# EAGLE design DorothiController (EAGLE 9.2.2)

## Sheet 1 of 3
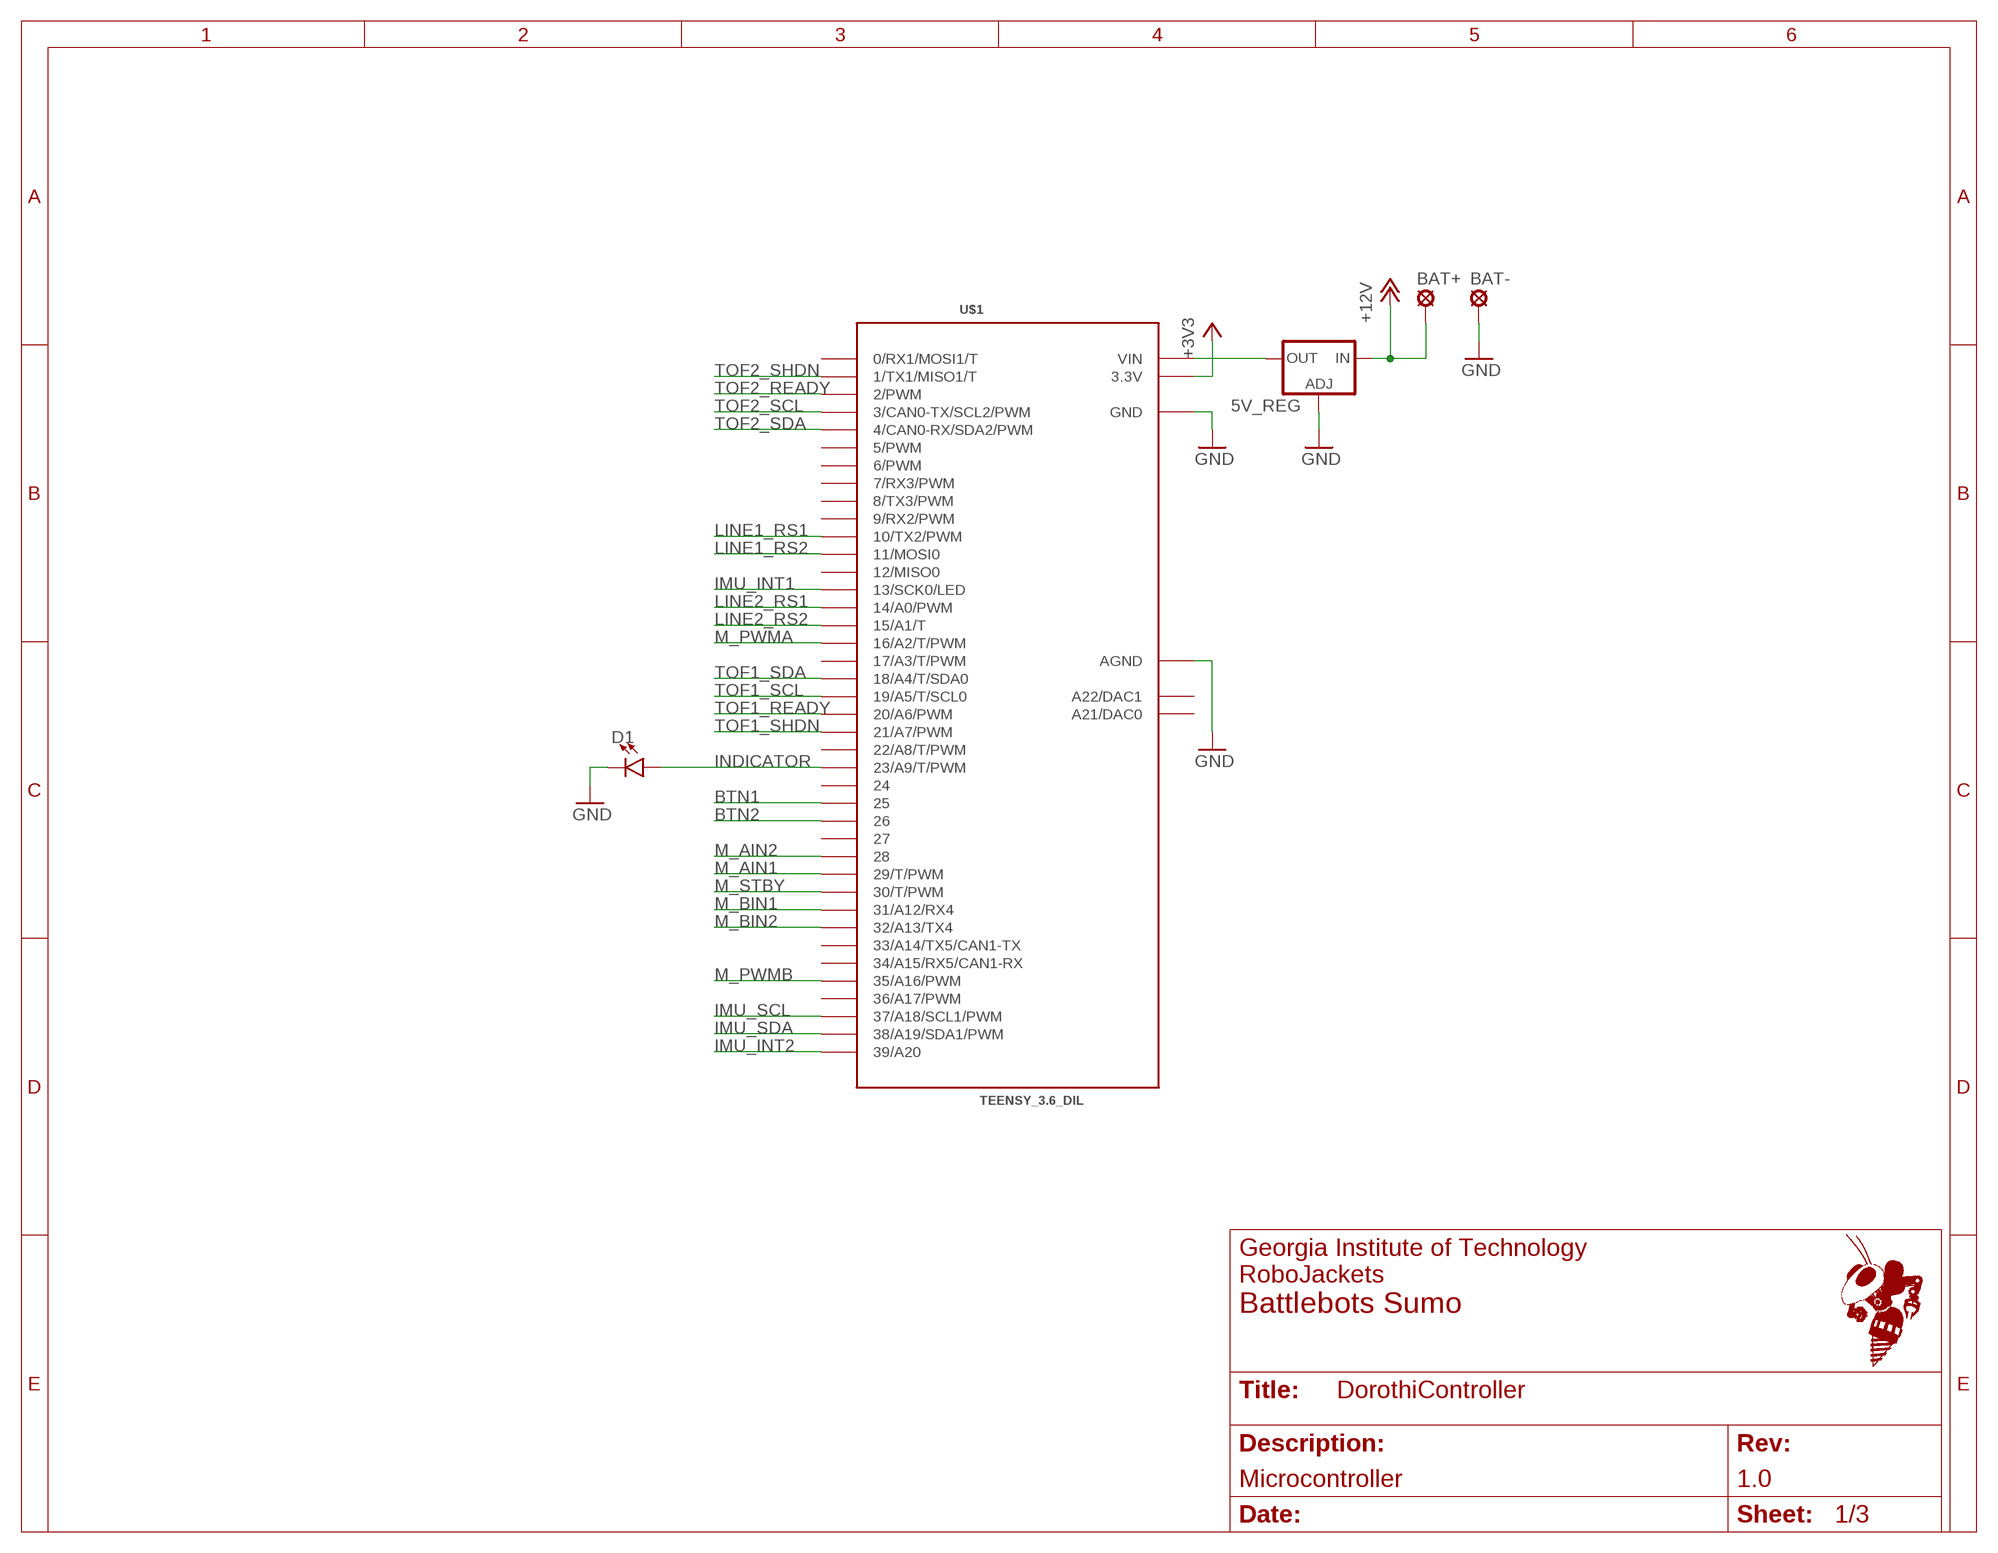
[diagram p0: schematic, sheet 1]
FRAME4 (FRAME_A_L): REVISION: 1.0; SCH_DESC: Microcontroller; TEAM: Battlebots Sumo

### Parts
5V_REG  LM138-TL  [TO220L1]
BAT+  24_SOLPAD  [WIRE_SOLPAD]
BAT-  24_SOLPAD  [WIRE_SOLPAD]
D1  LED0603  [LED-0603]
U$1  TEENSY_3.6_DIL  [TEENSY_3.6_DIL]

### Nets
5V_OUT: 5V_REG.2(OUT) U$1.VIN
+3V3: U$1.3.3V U$1.3.3V3(3.3V) ; also sheet 2,3
+12V: 5V_REG.3(IN) BAT+.P$1(MP) ; also sheet 2
BTN1: U$1.25 ; also sheet 3
BTN2: U$1.26 ; also sheet 3
GND: 5V_REG.1(ADJ) BAT-.P$1(MP) D1.C U$1.AGND U$1.GND U$1.GND1(GND) ; also sheet 2,3
IMU_INT1: U$1.13(13/SCK0/LED) ; also sheet 3
IMU_INT2: U$1.39/A20 ; also sheet 3
IMU_SCL: U$1.37/A18(37/A18/SCL1/PWM) ; also sheet 3
IMU_SDA: U$1.38/A19(38/A19/SDA1/PWM) ; also sheet 3
INDICATOR: D1.A U$1.23/A9(23/A9/T/PWM)
LINE1_RS1: U$1.10(10/TX2/PWM) ; also sheet 3
LINE1_RS2: U$1.11(11/MOSI0) ; also sheet 3
LINE2_RS1: U$1.14/A0(14/A0/PWM) ; also sheet 3
LINE2_RS2: U$1.15/A1(15/A1/T) ; also sheet 3
M_AIN1: U$1.29(29/T/PWM) ; also sheet 2
M_AIN2: U$1.28 ; also sheet 2
M_BIN1: U$1.31/A12(31/A12/RX4) ; also sheet 2
M_BIN2: U$1.32/A13(32/A13/TX4) ; also sheet 2
M_PWMA: U$1.16/A2(16/A2/T/PWM) ; also sheet 2
M_PWMB: U$1.35/A16(35/A16/PWM) ; also sheet 2
M_STBY: U$1.30(30/T/PWM) ; also sheet 2
TOF1_READY: U$1.20/A6(20/A6/PWM) ; also sheet 3
TOF1_SCL: U$1.19/A5(19/A5/T/SCL0) ; also sheet 3
TOF1_SDA: U$1.18/A4(18/A4/T/SDA0) ; also sheet 3
TOF1_SHDN: U$1.21/A7(21/A7/PWM) ; also sheet 3
TOF2_READY: U$1.2(2/PWM) ; also sheet 3
TOF2_SCL: U$1.3(3/CAN0-TX/SCL2/PWM) ; also sheet 3
TOF2_SDA: U$1.4(4/CAN0-RX/SDA2/PWM) ; also sheet 3
TOF2_SHDN: U$1.1(1/TX1/MISO1/T) ; also sheet 3
Unconnected: U$1.0(0/RX1/MOSI1/T) U$1.5(5/PWM) U$1.6(6/PWM) U$1.7(7/RX3/PWM) U$1.8(8/TX3/PWM) U$1.9(9/RX2/PWM) U$1.12(12/MISO0) U$1.17/A3(17/A3/T/PWM) U$1.22/A8(22/A8/T/PWM) U$1.24 U$1.27 U$1.33/A14(33/A14/TX5/CAN1-TX) U$1.34/A15(34/A15/RX5/CAN1-RX) U$1.36/A17(36/A17/PWM) U$1.A21(A21/DAC0) U$1.A22(A22/DAC1)

## Sheet 2 of 3
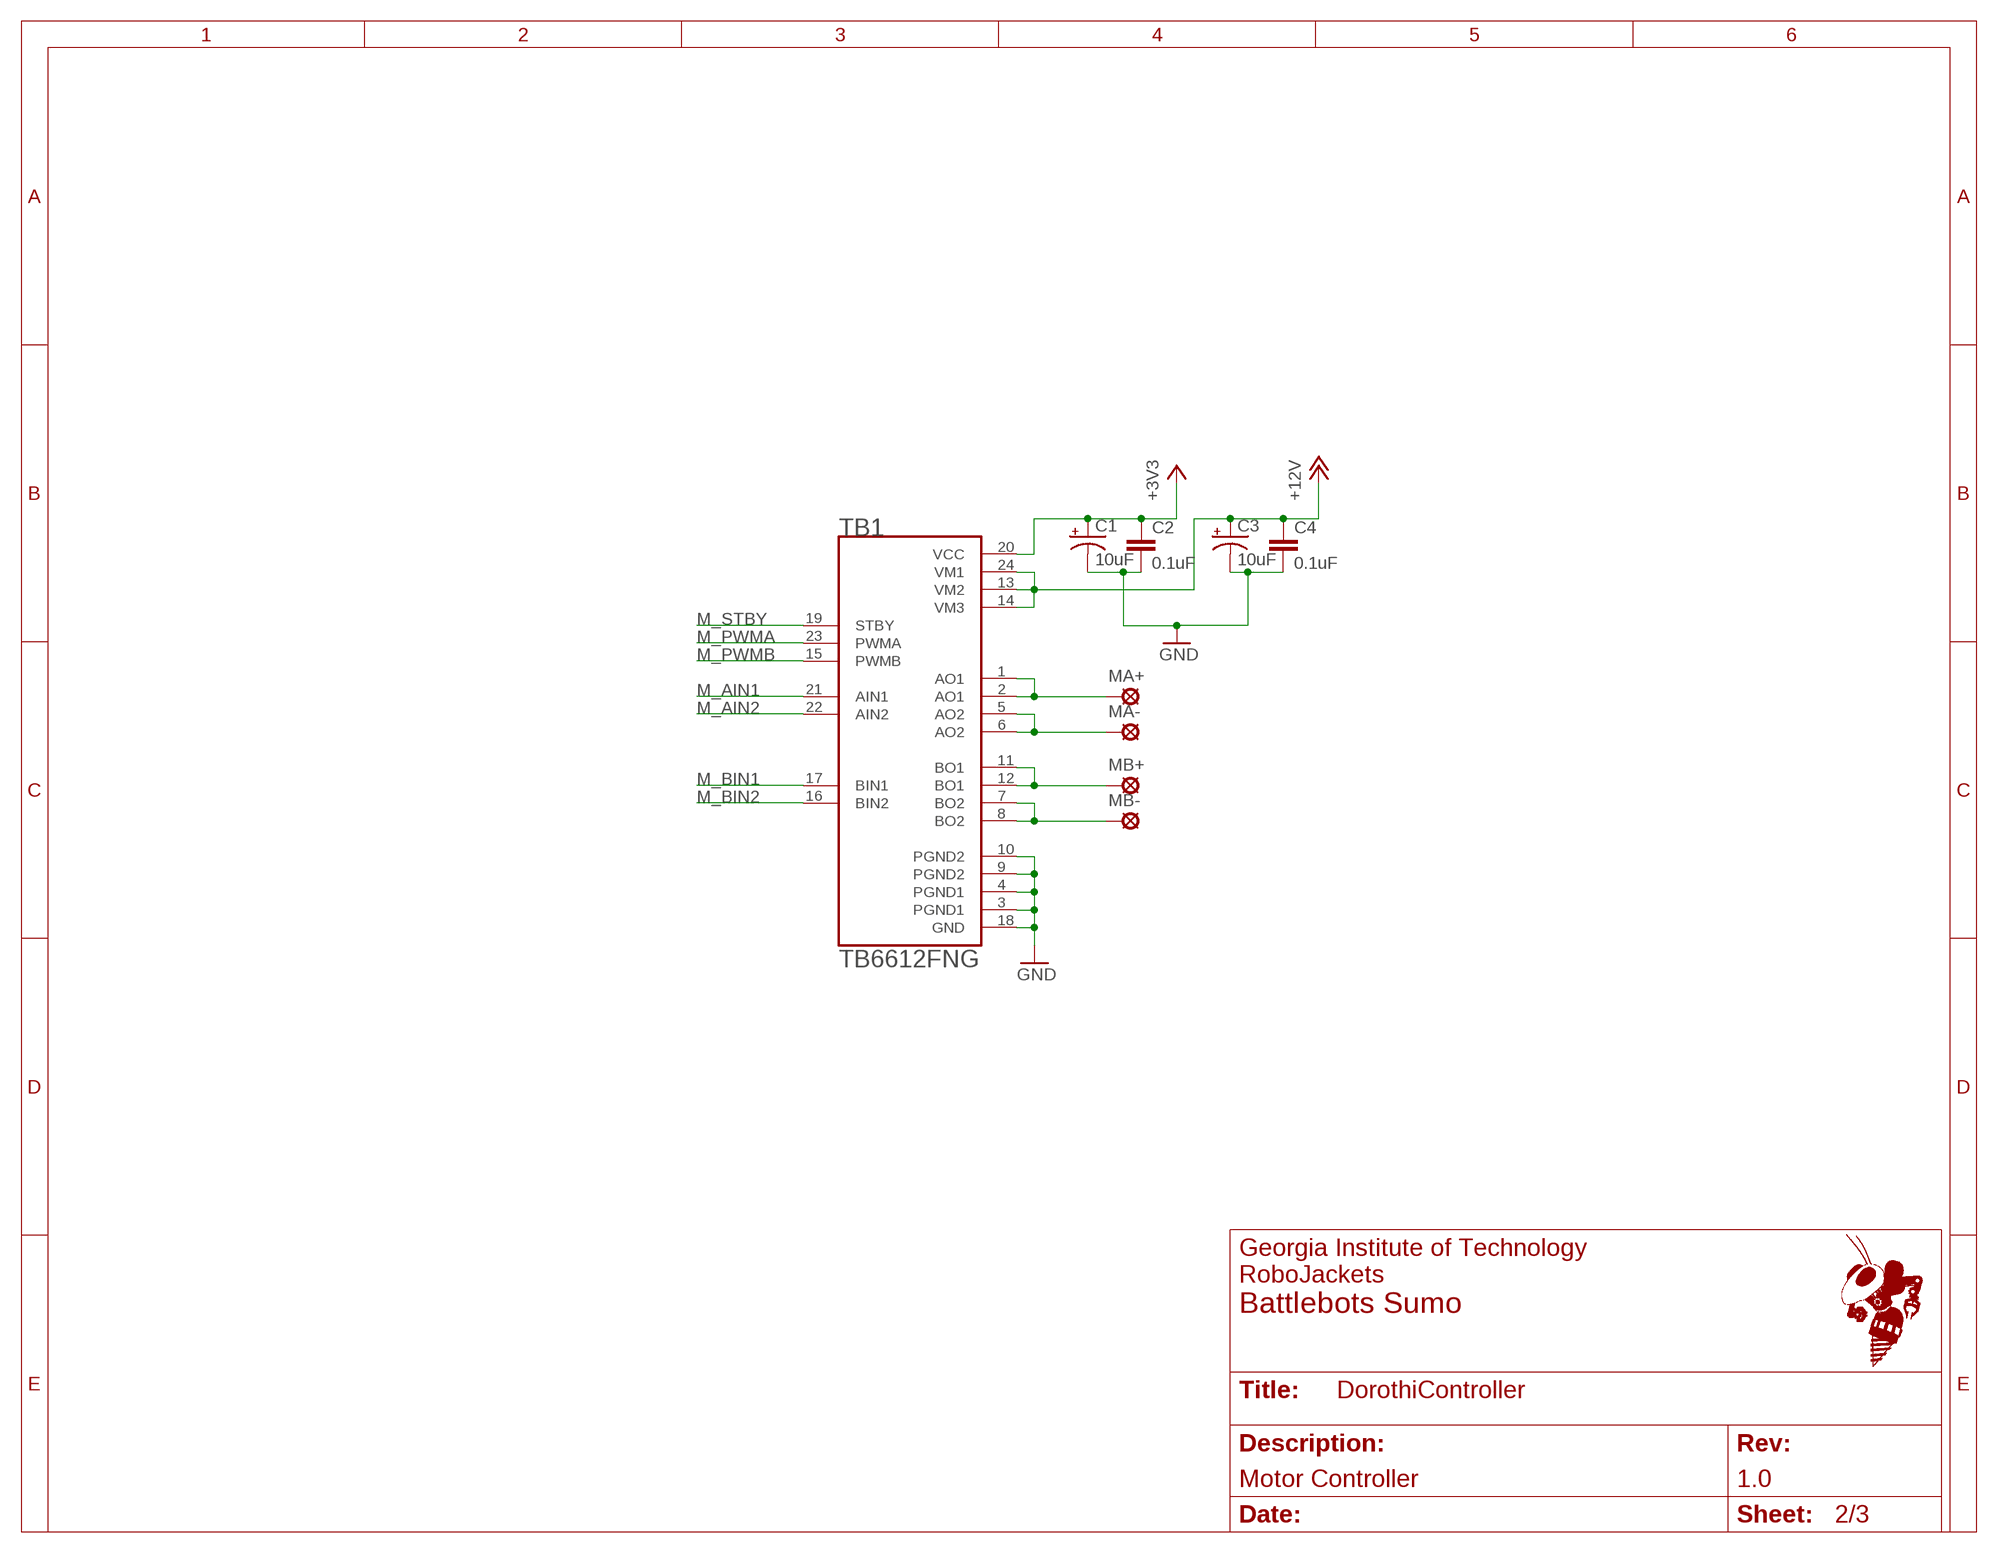
[diagram p1: schematic, sheet 2]
FRAME1 (FRAME_A_L): REVISION: 1.0; SCH_DESC: Motor Controller; TEAM: Battlebots Sumo

### Parts
C1  10uF  10UF-POLAR-EIA3528-20V-10%(TANT)  [EIA3528]
C2  0.1uF  0.1UF-0603-25V-5%  [0603]
C3  10uF  10UF-POLAR-EIA3528-20V-10%(TANT)  [EIA3528]
C4  0.1uF  0.1UF-0603-25V-5%  [0603]
MA+  24_SOLPAD  [WIRE_SOLPAD]
MA-  24_SOLPAD  [WIRE_SOLPAD]
MB+  24_SOLPAD  [WIRE_SOLPAD]
MB-  24_SOLPAD  [WIRE_SOLPAD]
TB1  TB6612FNG  TB6612FNG(O,C,8,EL  [SOP65P760X160-24N]

### Nets
+3V3: C1.A(+) C2.1 TB1.20(VCC) ; also sheet 1,3
+12V: C3.A(+) C4.1 TB1.13(VM2) TB1.14(VM3) TB1.24(VM1) ; also sheet 1
GND: C1.C(-) C2.2 C3.C(-) C4.2 TB1.3(PGND1) TB1.4(PGND1) TB1.9(PGND2) TB1.10(PGND2) TB1.18(GND) ; also sheet 1,3
M_AIN1: TB1.21(AIN1) ; also sheet 1
M_AIN2: TB1.22(AIN2) ; also sheet 1
M_BIN1: TB1.17(BIN1) ; also sheet 1
M_BIN2: TB1.16(BIN2) ; also sheet 1
M_PWMA: TB1.23(PWMA) ; also sheet 1
M_PWMB: TB1.15(PWMB) ; also sheet 1
M_STBY: TB1.19(STBY) ; also sheet 1
MA+: MA+.P$1(MP) TB1.1(AO1) TB1.2(AO1)
MA-: MA-.P$1(MP) TB1.5(AO2) TB1.6(AO2)
MB+: MB+.P$1(MP) TB1.11(BO1) TB1.12(BO1)
MB-: MB-.P$1(MP) TB1.7(BO2) TB1.8(BO2)

## Sheet 3 of 3
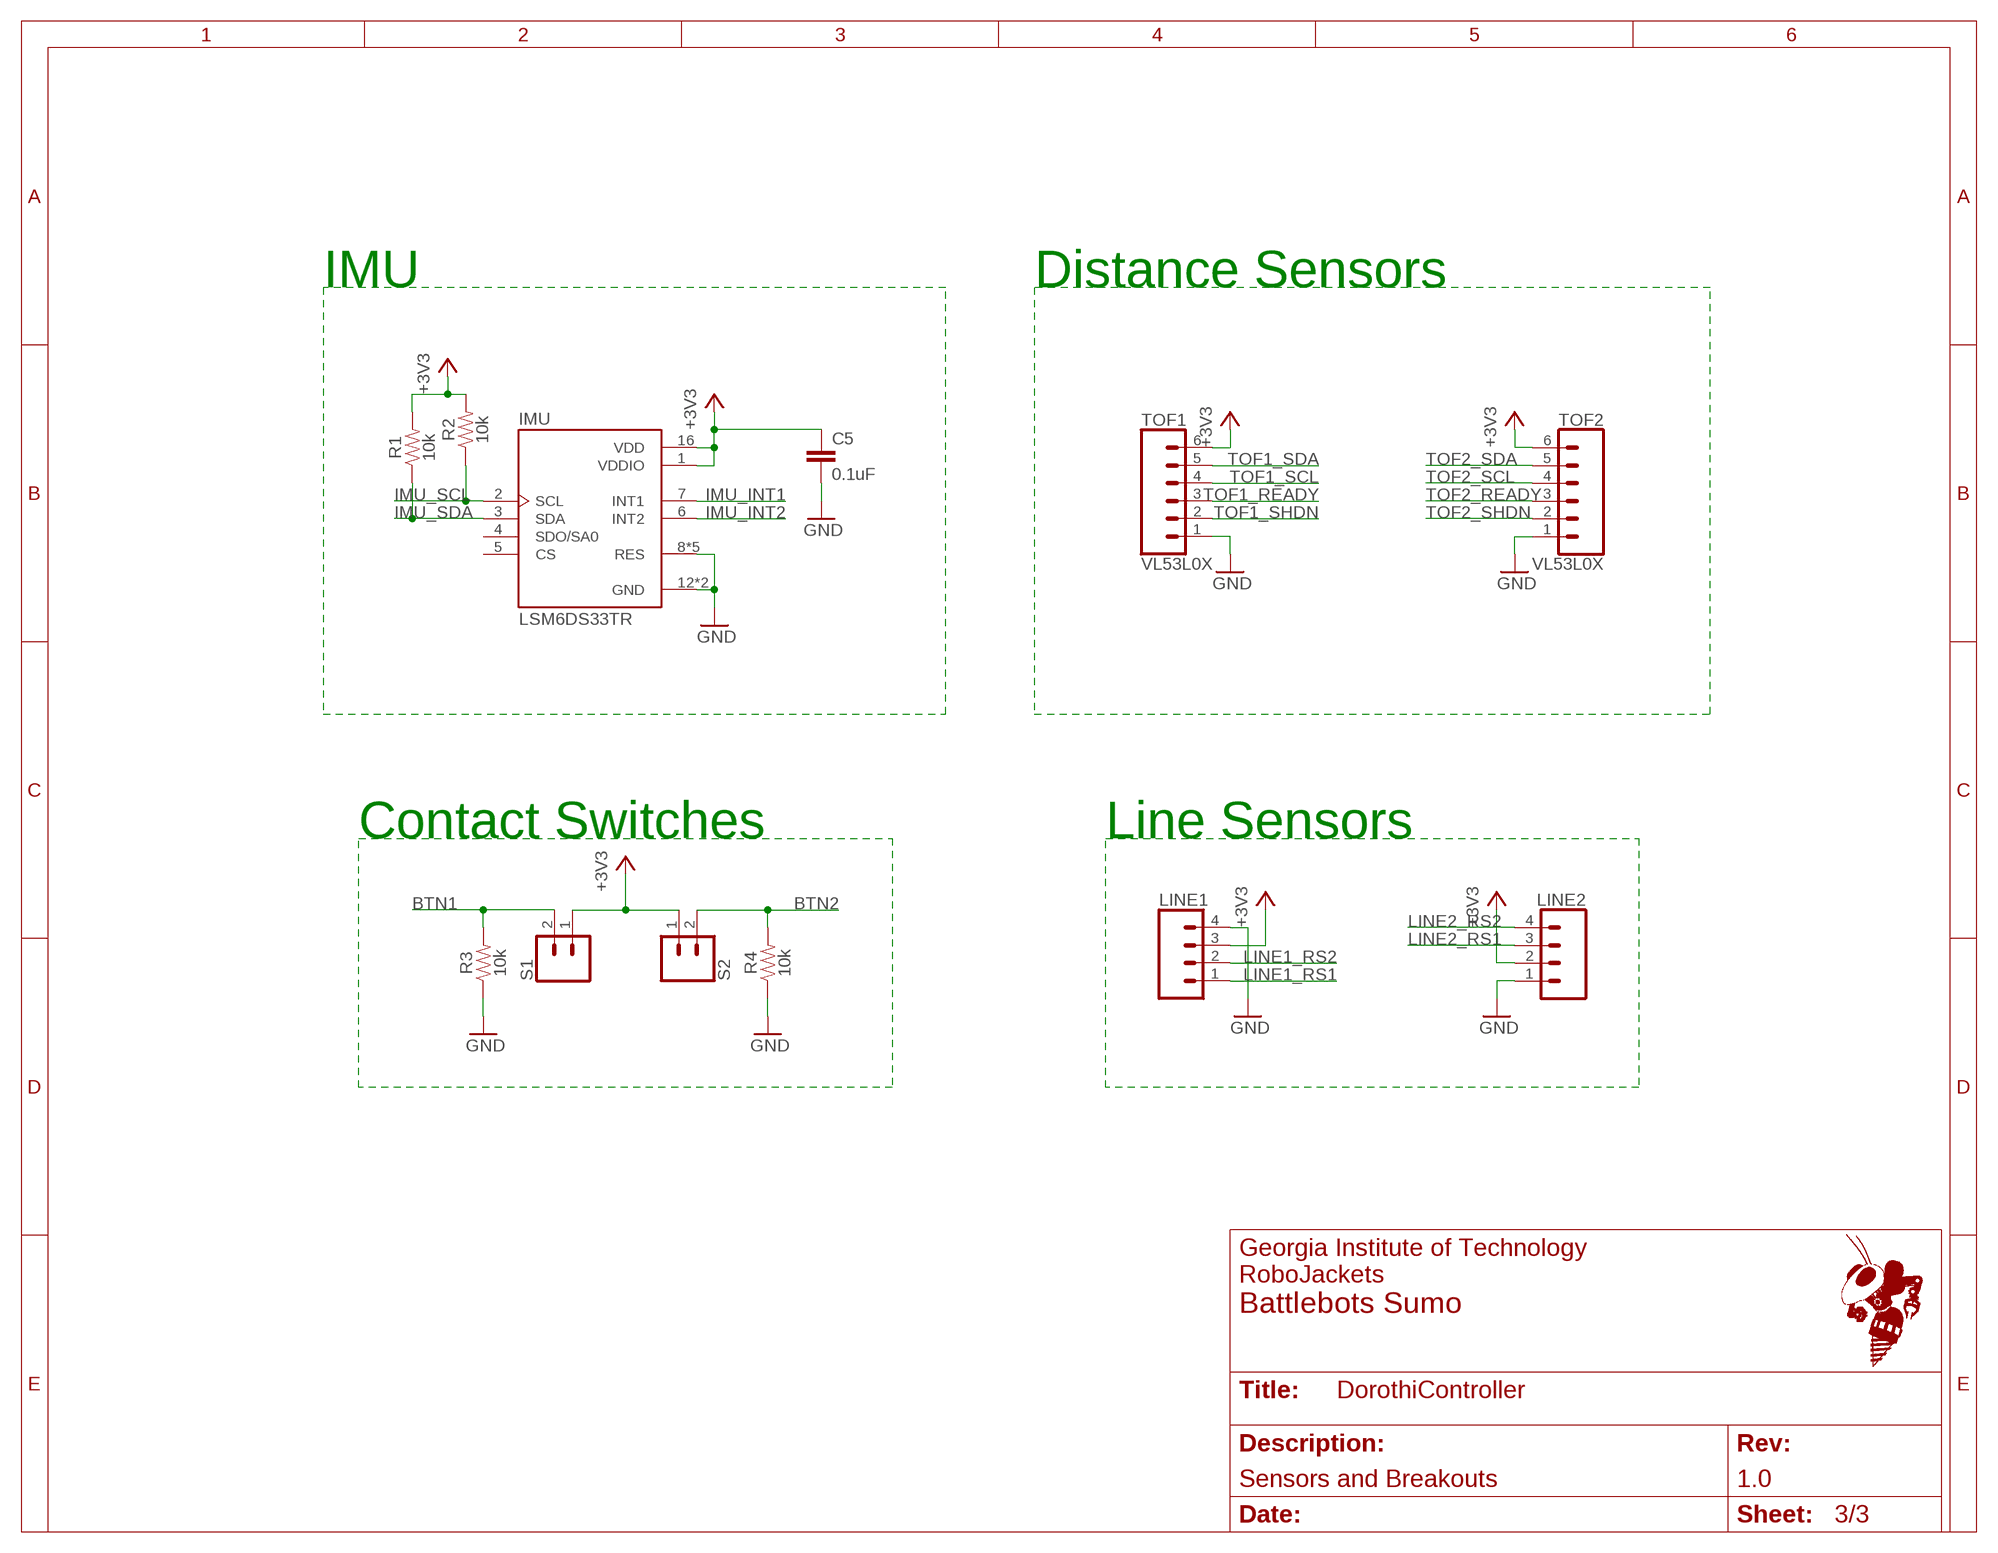
[diagram p2: schematic, sheet 3]
FRAME2 (FRAME_A_L): REVISION: 1.0; SCH_DESC: Sensors and Breakouts; TEAM: Battlebots Sumo

### Parts
C5  0.1uF  0.1UF-0603-25V-5%  [0603]
IMU  LSM6DS33TR  [PQFN50P300X300X86-16N]
LINE1  CONN_04  [1X04]
LINE2  CONN_04  [1X04]
R1  10k  10KOHM-0603-1/10W-1%  [0603]
R2  10k  10KOHM-0603-1/10W-1%  [0603]
R3  10k  10KOHM-0603-1/10W-1%  [0603]
R4  10k  10KOHM-0603-1/10W-1%  [0603]
S1  CONN_02  [1X02]
S2  CONN_02  [1X02]
TOF1  VL53L0X  CONN_06SILK_FEMALE_PTH  [1X06]
TOF2  VL53L0X  CONN_06SILK_FEMALE_PTH  [1X06]

### Nets
+3V3: C5.1 IMU.1(VDDIO) IMU.16(VDD) LINE1.3 LINE2.2 R1.2 R2.2 S1.1 S2.1 TOF1.6 TOF2.6 ; also sheet 1,2
BTN1: R3.2 S1.2 ; also sheet 1
BTN2: R4.2 S2.2 ; also sheet 1
GND: C5.2 IMU.8(RES) IMU.9(RES) IMU.10(RES) IMU.11(RES) IMU.12(GND) IMU.13(GND) IMU.15(RES) LINE1.4 LINE2.1 R3.1 R4.1 TOF1.1 TOF2.1 ; also sheet 1,2
IMU_INT1: IMU.7(INT1) ; also sheet 1
IMU_INT2: IMU.6(INT2) ; also sheet 1
IMU_SCL: IMU.2(SCL) R2.1 ; also sheet 1
IMU_SDA: IMU.3(SDA) R1.1 ; also sheet 1
LINE1_RS1: LINE1.1 ; also sheet 1
LINE1_RS2: LINE1.2 ; also sheet 1
LINE2_RS1: LINE2.3 ; also sheet 1
LINE2_RS2: LINE2.4 ; also sheet 1
TOF1_READY: TOF1.3 ; also sheet 1
TOF1_SCL: TOF1.4 ; also sheet 1
TOF1_SDA: TOF1.5 ; also sheet 1
TOF1_SHDN: TOF1.2 ; also sheet 1
TOF2_READY: TOF2.3 ; also sheet 1
TOF2_SCL: TOF2.4 ; also sheet 1
TOF2_SDA: TOF2.5 ; also sheet 1
TOF2_SHDN: TOF2.2 ; also sheet 1
Unconnected: IMU.4(SDO/SA0) IMU.5(CS)

### Notes on the sheet
- IMU | Distance Sensors
- Contact Switches | Line Sensors

## Library data of the parts
5V_REG = v-reg:LM138-TL: VOLTAGE REGULATOR
BAT+ BAT- MA+ MA- MB+ MB- = nickZhang:2*4_SOLPAD: SOLDER PAD RTM, drill 1,1mm, distributor Buerklin, 07F810
C1 C3 = SparkFun-Capacitors:10UF-POLAR: 10.0µF polarized capacitors A capacitor is a passive two-terminal electrical component used to store electrical energy temporarily in an electric field.; PROD_ID: CAP-08063
C2 C4 C5 = SparkFun-Capacitors:0.1UF: 0.1µF ceramic capacitors A capacitor is a passive two-terminal electrical component used to store electrical energy temporarily in an electric field.; PROD_ID: CAP-08604
D1 = SparkFun-LED:LED: LED (Generic) Standard schematic elements and footprints for 5mm, 3mm, 1206, and 0603 sized LEDs. Generic LEDs with no color specified.
IMU = LSM6DS33TR:LSM6DS33TR: Integrated Circuit, Misc s 3d Accelerometer And Gyro Lsm6ds3; AVAILABILITY: Unavailable; DESCRIPTION: Integrated Circuit, Misc s 3d Accelerometer And Gyro Lsm6ds3; MF: STMicroelectronics; MP: LSM6DS33TR; PACKAGE: LGA-16 STMicroelectronics; PRICE: None
LINE1 LINE2 = SparkFun-Connectors:CONN_04: Multi connection point. Often used as Generic Header-pin footprint for 0.1 inch spaced/style header connections On any of the 0.1 inch spaced packages, you can populate with these: Break Away Headers - Straight <https://www.sparkfun.com/products/116> (PRT-00116) Break Away Male Headers - Right Angle <https://www.sparkfun.com/products/553> (PRT-00553) Female Headers <https://www.sparkfun.com/products/115> (PRT-00115) Break Away Headers - Machine Pin <https://www.sparkfun.com/products/117> (PRT-00117) Break Away Female Headers - Swiss Machine Pin <https://www.sparkfun.com/products/743> (PRT-00743) For SCREWTERMINALS and SPRING TERMINALS visit here: Screw Terimnals on SparkFun.com <https://www.sparkfun.com/search/results?term=Screw+Terminals> (5mm/3.5mm/2.54mm spacing) This device is also useful as a general connection point to wire up your design to another part of your project. Our various solder wires solder well into these plated through hole pads. Hook-Up Wire - Assortment (Stranded, 22 AWG) <https://www.sparkfun.com/products/11375> (PRT-11375) Hook-Up Wire - Assortment (Solid Core, 22 AWG) <https://www.sparkfun.com/products/11367> (PRT-11367) View the entire wire category on our website here <https://www.sparkfun.com/categories/141> Special notes: Molex polarized connector foot print use with SKU : PRT-08231 with associated crimp pins and housings. 1MM SMD Version SKU: PRT-10208; PROD_ID: CONN-09696
R1-R4 = SparkFun-Resistors:10KOHM: 10kΩ resistor A resistor is a passive two-terminal electrical component that implements electrical resistance as a circuit element. Resistors act to reduce current flow, and, at the same time, act to lower voltage levels within circuits. - Wikipedia; PROD_ID: RES-00824
S1 S2 = SparkFun-Connectors:CONN_02: Multi connection point. Often used as Generic Header-pin footprint for 0.1 inch spaced/style header connections On any of the 0.1 inch spaced packages, you can populate with these: Break Away Headers - Straight <https://www.sparkfun.com/products/116> (PRT-00116) Break Away Male Headers - Right Angle <https://www.sparkfun.com/products/553> (PRT-00553) Female Headers <https://www.sparkfun.com/products/115> (PRT-00115) Break Away Headers - Machine Pin <https://www.sparkfun.com/products/117> (PRT-00117) Break Away Female Headers - Swiss Machine Pin <https://www.sparkfun.com/products/743> (PRT-00743) For SCREWTERMINALS and SPRING TERMINALS visit here: Screw Terimnals on SparkFun.com <https://www.sparkfun.com/search/results?term=Screw+Terminals> (5mm/3.5mm/2.54mm spacing) This device is also useful as a general connection point to wire up your design to another part of your project. Our various solder wires solder well into these plated through hole pads. Hook-Up Wire - Assortment (Stranded, 22 AWG) <https://www.sparkfun.com/products/11375> (PRT-11375) Hook-Up Wire - Assortment (Solid Core, 22 AWG) <https://www.sparkfun.com/products/11367> (PRT-11367) View the entire wire category on our website here <https://www.sparkfun.com/categories/141> Special notes: Molex polarized connector foot print use with: PRT-08233 with associated crimp pins and housings. 2.54_SCREWTERM for use with PRT-10571. 3.5mm Screw Terminal footprints for PRT-08084 5mm Screw Terminal footprints for use with PRT-08432
TB1 = TB6612FNG:TB6612FNG(O,C,8,EL: Stepping Motor Driver Ic Unipolor Copper Wire 8"; AVAILABILITY: Unavailable; DESCRIPTION: Stepping Motor Driver Ic Unipolor Copper Wire 8; MF: Toshiba; MP: TB6612FNG_O,C,8,EL; PACKAGE: SSOP-24 Toshiba; PRICE: None
TOF1 TOF2 = SparkFun-Connectors:CONN_06: Multi connection point. Often used as Generic Header-pin footprint for 0.1 inch spaced/style header connections On any of the 0.1 inch spaced packages, you can populate with these: Break Away Headers - Straight <https://www.sparkfun.com/products/116> (PRT-00116) Break Away Male Headers - Right Angle <https://www.sparkfun.com/products/553> (PRT-00553) Female Headers <https://www.sparkfun.com/products/115> (PRT-00115) Break Away Headers - Machine Pin <https://www.sparkfun.com/products/117> (PRT-00117) Break Away Female Headers - Swiss Machine Pin <https://www.sparkfun.com/products/743> (PRT-00743) Arduino Stackable Header - 6 Pin <https://www.sparkfun.com/products/9280> (PRT-09280) For SCREWTERMINALS and SPRING TERMINALS visit here: Screw Terimnals on SparkFun.com <https://www.sparkfun.com/search/results?term=Screw+Terminals> (5mm/3.5mm/2.54mm spacing) This device is also useful as a general connection point to wire up your design to another part of your project. Our various solder wires solder well into these plated through hole pads. Hook-Up Wire - Assortment (Stranded, 22 AWG) <https://www.sparkfun.com/products/11375> (PRT-11375) Hook-Up Wire - Assortment (Solid Core, 22 AWG) <https://www.sparkfun.com/products/11367> (PRT-11367) View the entire wire category on our website here <https://www.sparkfun.com/categories/141>; PROD_ID: CONN-08437
U$1 = Teensy_3_and_LC_Series_Boards_v1.4:TEENSY_3.6_DIL: Teensy 3.6 DIL Package

## Board
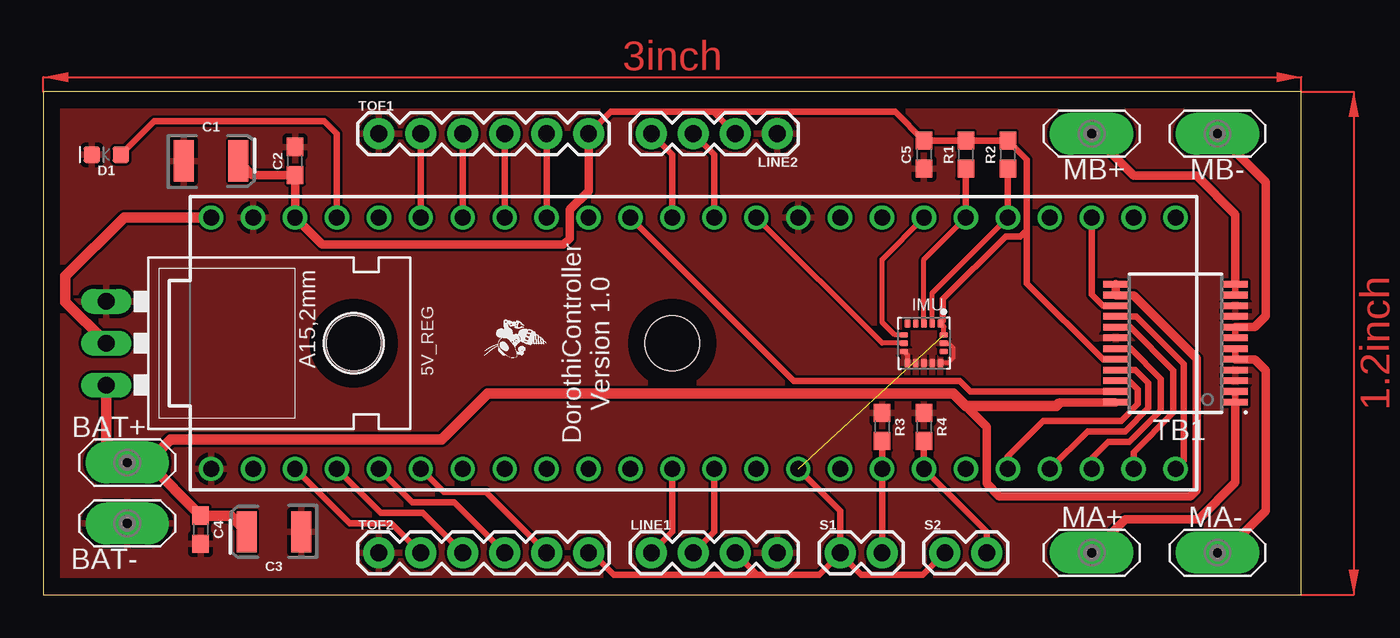
[diagram p3: board, top side]

Size 76.2 x 30.48 mm. Coordinates in mm from the lower left corner, seen from the top.
Outline: 0,0 76.2,0 76.2,30.48 0,30.48 0,0
Copper layers (1*16): Top 0.035mm / dielectric 1.5mm / Bottom 0.035mm
Design rules "default": minimum track width 6mil, minimum drill 0.35mm, track to track 6mil, track to pad 6mil, pad to pad 6mil, via to via 6mil, smd to smd 6mil, copper to edge 40mil, drill to drill 6mil, minimum pad ring 10mil, minimum via ring 8mil, stop-mask expansion 4mil, vias tented up to drill 0mil, thermal gap 10mil
Holes 3.3 mm at 38.1,15.24

### Footprints (pad centres in the part's own frame; a part is rotated, then mirrored left to right if it is on the bottom)
TO220L1 = drill 1.016 long: 1 -2.54,-3.81; 2 0,-3.81; 3 2.54,-3.81 | hole 3.302: 0,11.176
WIRE_SOLPAD = drill 0.6 pad 2.54 long: P$1 0,0
EIA3528 = smd 1.2 x 2.5: A 1.65,0; C -1.65,0
0603 = smd 1.1 x 1: 1 -0.85,0; 2 0.85,0
LED-0603 = smd 1 x 1: A -0.877,0; C 0.877,0
PQFN50P300X300X86-16N = smd 0.51 x 0.35: 1 -1.21,1; 2 -1.21,0.5; 3 -1.21,0; 4 -1.21,-0.5; 5 -1.21,-1; 9 1.21,-1; 10 1.21,-0.5; 11 1.21,0; 12 1.21,0.5; 13 1.21,1 | smd 0.35 x 0.51: 6 -0.5,-1.21; 7 0,-1.21; 8 0.5,-1.21; 14 0.5,1.21; 15 0,1.21; 16 -0.5,1.21
1X04 = drill 1.016 pad 1.88: 1 0,0; 2 2.54,0; 3 5.08,0; 4 7.62,0
1X02 = drill 1.016 pad 1.88: 1 0,0; 2 2.54,0
SOP65P760X160-24N = smd 1.5 x 0.4: 1 -3.625,3.575; 2 -3.625,2.925; 3 -3.625,2.275; 4 -3.625,1.625; 5 -3.625,0.975; 6 -3.625,0.325; 7 -3.625,-0.325; 8 -3.625,-0.975; 9 -3.625,-1.625; 10 -3.625,-2.275; 11 -3.625,-2.925; 12 -3.625,-3.575; 13 3.625,-3.575; 14 3.625,-2.925; 15 3.625,-2.275; 16 3.625,-1.625; 17 3.625,-0.975; 18 3.625,-0.325; 19 3.625,0.325; 20 3.625,0.975; 21 3.625,1.625; 22 3.625,2.275; 23 3.625,2.925; 24 3.625,3.575
1X06 = drill 1.016 pad 1.88: 1 0,0; 2 2.54,0; 3 5.08,0; 4 7.62,0; 5 10.16,0; 6 12.7,0
TEENSY_3.6_DIL = drill 0.965: 0 -7.62,25.4; 1 -7.62,22.86; 2 -7.62,20.32; 3 -7.62,17.78; 3.3V 7.62,22.86; 3.3V3 -7.62,-7.62; 4 -7.62,15.24; 5 -7.62,12.7; 6 -7.62,10.16; 7 -7.62,7.62; 8 -7.62,5.08; 9 -7.62,2.54; 10 -7.62,0; 11 -7.62,-2.54; 12 -7.62,-5.08; 13 7.62,-5.08; 14/A0 7.62,-2.54; 15/A1 7.62,0; 16/A2 7.62,2.54; 17/A3 7.62,5.08; 18/A4 7.62,7.62; 19/A5 7.62,10.16; 20/A6 7.62,12.7; 21/A7 7.62,15.24; 22/A8 7.62,17.78; 23/A9 7.62,20.32; 24 -7.62,-10.16; 25 -7.62,-12.7; 26 -7.62,-15.24; 27 -7.62,-17.78; 28 -7.62,-20.32; 29 -7.62,-22.86; 30 -7.62,-25.4; 31/A12 -7.62,-27.94; 32/A13 -7.62,-30.48; 33/A14 7.62,-30.48; 34/A15 7.62,-27.94; 35/A16 7.62,-25.4; 36/A17 7.62,-22.86; 37/A18 7.62,-20.32; 38/A19 7.62,-17.78; 39/A20 7.62,-15.24; A21 7.62,-12.7; A22 7.62,-10.16; AGND 7.62,25.4; GND -7.62,27.94; GND1 7.62,-7.62; VIN 7.62,27.94

### Placement (x,y rotation side)
5V_REG  7.62,15.24 270 top
BAT+  5.08,8 180 top
BAT-  5.08,4.32 180 top
C1  10.16,26.29 0 top
C2  15.24,26.29 90 top
C3  13.97,3.81 180 top
C4  9.53,3.94 270 top
C5  53.34,26.67 270 top
D1  3.81,26.67 180 top
IMU  53.34,15.24 270 top
LINE1  36.83,2.54 0 top
LINE2  44.45,27.94 180 top
MA+  63.5,2.54 180 top
MA-  71.12,2.54 180 top
MB+  63.5,27.94 180 top
MB-  71.12,27.94 180 top
R1  55.88,26.67 90 top
R2  58.42,26.67 90 top
R3  50.8,10.16 270 top
R4  53.34,10.16 270 top
S1  48.26,2.54 0 top
S2  54.61,2.54 0 top
TB1  68.58,15.24 180 top
TOF1  20.32,27.94 0 top
TOF2  20.32,2.54 0 top
U$1  38.1,15.24 90 top
U$2  ROBOBUZZ0.2X  [ROBOBUZZ_0.2X]  30.48,15.24 90 top

### Tracks (layer width: path | path; a pad name or v marks a point on that pad's centre or on a via)
5V_OUT
  Top 0.635: 5V_REG.2 3.81,15.28 1.33,17.75 1.33,19.3 4.89,22.86 U$1.VIN
+3V3  (1 unrouted)
  Top 0.305: IMU.16 54.55,16.24 IMU.1
  Top 0.33: IMU.1 54.48,16.59
  Top 0.381: U$1.3.3V3 48.26,5.08 S1.1 48.26,2.48 | S2.1 53.28,1.21 49.53,1.21 48.26,2.48 | TB1.20 64.94,14.24 64.19,14.24 59.56,18.87 59.56,22.1 | TOF2.6 33.21,2.54 34.54,1.21 43.18,1.21 | 43.18,1.21 46.99,1.21 48.26,2.48 | TOF1.6 34.35,29.27 40.58,29.27 | 40.58,29.27 LINE2.2 | 59.56,22.1 59.18,21.72 58.29,21.72 54.48,17.91 54.48,16.59 | 59.56,22.1 59.56,26.38 R2.2 R1.2 C5.1 51.59,29.27 40.58,29.27 | LINE1.3 43.18,1.27 43.18,1.21
  Top 0.508: TOF1.6 33.02,24.48 31.88,23.33 31.88,21.59 31.5,21.21 16.89,21.21 U$1.3.3V C2.1 12.66,25.44 C1.A
+12V
  Top 0.508: TB1.13 TB1.14 65,18.12 66.03,18.12 69.85,14.31 69.85,6.35 69.47,5.97 57.91,5.97 57.15,6.73 57.15,10.16 55.88,11.43 | TB1.24 61.58,11.66 61.47,11.56
  Top 0.635: C3.A 11.34,4.79 C4.1 6.31,8 | 6.31,8 BAT+.P$1 3.81,9.27 5V_REG.3 | 6.31,8 7.71,9.4 24.13,9.4 26.92,12.19 55.12,12.19 55.88,11.43 61.34,11.43 61.47,11.56
BTN1
  Top 0.381: S1.2 U$1.25 R3.2
BTN2
  Top 0.381: S2.2 57.15,3.81 U$1.26 R4.2
GND
  Top 0.254: IMU.15 54.6,15.19 54.9,15.19 55.12,14.97 55.12,14.35 54.8,14.03 IMU.13
  Top 0.305: IMU.8 52.34,14.53 IMU.9
  pour Top: 0,0 0,30.48 76.2,30.48 76.2,0
IMU_INT1
  Top 0.305: IMU.7 50.8,15.24 U$1.13
IMU_INT2
  Top 0.305: IMU.6 51.57,15.74 50.8,16.51 50.8,20.32 U$1.39/A20
IMU_SCL
  Top 0.305: IMU.2 53.84,18.28 U$1.37/A18
  Top 0.381: R2.1 U$1.37/A18
IMU_SDA
  Top 0.305: IMU.3 53.34,20.32 U$1.38/A19
  Top 0.381: R1.1 U$1.38/A19
INDICATOR
  Top 0.381: U$1.23/A9 17.78,27.94 17.02,28.7 6.72,28.7 D1.A
LINE1_RS1
  Top 0.381: LINE1.1 38.1,3.81 U$1.10
LINE1_RS2
  Top 0.381: LINE1.2 40.64,3.81 U$1.11
LINE2_RS1
  Top 0.381: U$1.14/A0 40.64,26.67 LINE2.3
LINE2_RS2
  Top 0.381: U$1.15/A1 38.1,26.67 LINE2.4
M_AIN1
  Top 0.381: TB1.21 66.14,13.62 66.93,12.83 66.93,11.3 65.53,9.91 63.25,9.91 U$1.29
M_AIN2
  Top 0.381: TB1.22 65.78,12.96 66.29,12.45 66.29,11.56 65.28,10.54 60.58,10.54 58.42,8.38 U$1.28
M_BIN1
  Top 0.381: TB1.17 65.83,16.21 68.45,13.59 68.45,11.05 66.04,8.64 U$1.31/A12
M_BIN2
  Top 0.381: TB1.16 66.19,16.86 69.09,13.97 69.09,8.13 U$1.32/A13
M_PWMA
  Top 0.381: TB1.23 56.14,12.31 55.5,12.95 45.47,12.95 U$1.16/A2
M_PWMB
  Top 0.381: TB1.15 64.16,17.52 63.5,18.18 U$1.35/A16
M_STBY
  Top 0.381: TB1.19 65.86,14.91 67.69,13.08 67.69,11.18 65.79,9.27 64.52,9.27 63.5,8.26 U$1.30
MA+
  Top 0.381: TB1.1 TB1.2
  Top 0.508: TB1.1 72.2,6.8 69.98,4.57 65.53,4.57 MA+.P$1
MA-
  Top 0.381: TB1.5 TB1.6
  Top 0.508: TB1.5 73.36,14.27 74.04,13.59 74.04,5.08 71.5,2.54 MA-.P$1
MB+
  Top 0.381: TB1.11 TB1.12
  Top 0.508: TB1.12 72.2,23.05 69.85,25.4 66.04,25.4 MB+.P$1
MB-
  Top 0.381: TB1.7 TB1.8
  Top 0.508: MB-.P$1 74.04,25.02 74.04,16.89 73.36,16.21 TB1.8
TOF1_READY
  Top 0.381: U$1.20/A6 TOF1.3
TOF1_SCL
  Top 0.381: U$1.19/A5 TOF1.4
TOF1_SDA
  Top 0.381: U$1.18/A4 TOF1.5
TOF1_SHDN
  Top 0.381: U$1.21/A7 TOF1.2
TOF2_READY
  Top 0.381: TOF2.3 22.99,4.95 20.45,4.95 U$1.2
TOF2_SCL
  Top 0.381: TOF2.4 24.89,5.59 22.35,5.59 U$1.3
TOF2_SDA
  Top 0.381: TOF2.5 26.8,6.22 24.26,6.22 U$1.4
TOF2_SHDN
  Top 0.381: TOF2.2 21.08,4.32 18.54,4.32 U$1.1
(copper drawn outside any net)
  shapes: Top area x2

### Text on the board
tPlace: DorothiController / Version 1.0